# EAGLE design SR-Daughter (EAGLE 7.5.0)
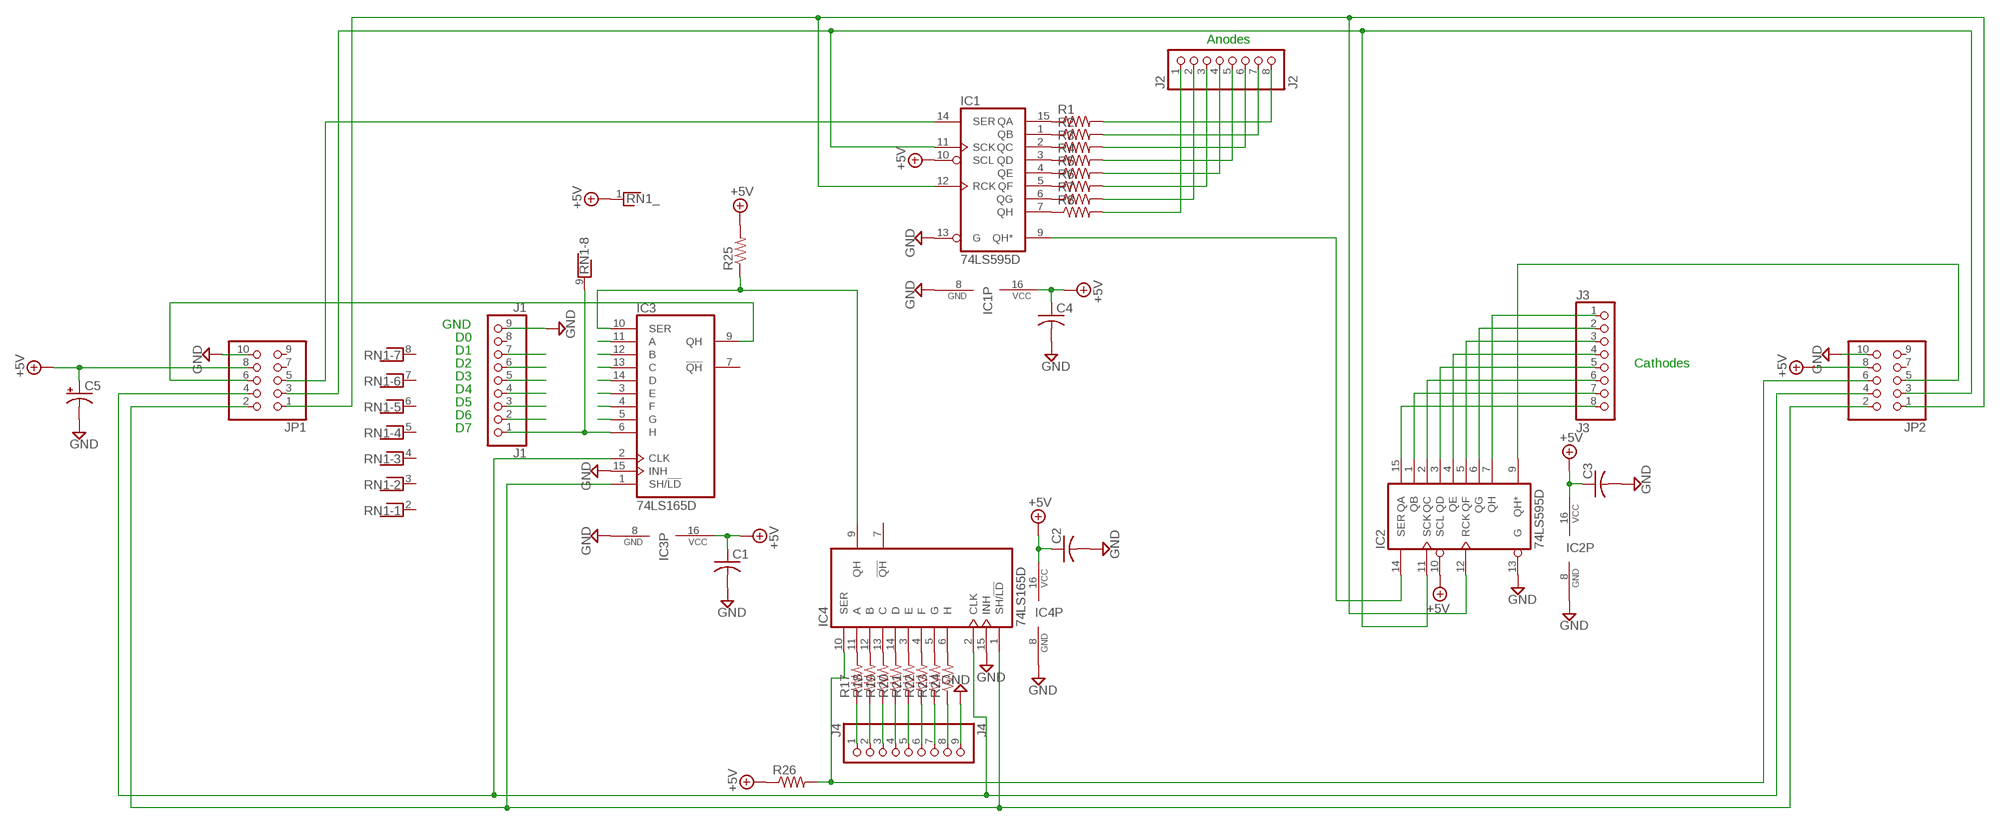
[diagram p0: schematic, sheet 1]

## Parts
C1  C-USC0603  [C0603]
C2  C-USC0603  [C0603]
C3  C-USC0603  [C0603]
C4  C-USC0603  [C0603]
C5  CPOL-USE2-5  [E2-5]
IC1  74LS595D  [SO16]
IC2  74LS595D  [SO16]
IC3  74LS165D  [SO16]
IC4  74LS165D  [SO16]
J1  J1  PINHD-1X9  [1X09]
J2  J2  PINHD-1X8  [1X08]
J3  J3  PINHD-1X8  [1X08]
J4  J4  PINHD-1X9  [1X09]
JP1  PINHD-2X5  [2X05]
JP2  PINHD-2X5  [2X05]
R1  R-US_M0805  [M0805]
R2  R-US_M0805  [M0805]
R3  R-US_M0805  [M0805]
R4  R-US_M0805  [M0805]
R5  R-US_M0805  [M0805]
R6  R-US_M0805  [M0805]
R7  R-US_M0805  [M0805]
R8  R-US_M0805  [M0805]
R17  R-US_M0805  [M0805]
R18  R-US_M0805  [M0805]
R19  R-US_M0805  [M0805]
R20  R-US_M0805  [M0805]
R21  R-US_M0805  [M0805]
R22  R-US_M0805  [M0805]
R23  R-US_M0805  [M0805]
R24  R-US_M0805  [M0805]
R25  R-US_M0805  [M0805]
R26  R-US_M0805  [M0805]
RN1  RNX8  [RN-9]

## Nets
+5V: C1.1 C2.1 C3.1 C4.1 C5.+ IC1.10(SCL) IC1.16(VCC) IC2.10(SCL) IC2.16(VCC) IC3.16(VCC) IC4.16(VCC) JP1.8 JP2.8 R25.2 R26.1 RN1.1
CLK0: IC3.2(CLK) IC4.2(CLK) JP1.4 JP2.4
CLK1: IC3.1(SH/!LD) IC4.1(SH/!LD) JP1.2 JP2.2
GND: C1.2 C2.2 C3.2 C4.2 C5.- IC1.8(GND) IC1.13(G) IC2.8(GND) IC2.13(G) IC3.8(GND) IC3.15(INH) IC4.8(GND) IC4.15(INH) J1.9 J4.9 JP1.10 JP2.10
N$1: IC1.15(QA) R1.1
N$2: IC1.1(QB) R2.1
N$3: IC1.2(QC) R3.1
N$4: IC1.3(QD) R4.1
N$5: IC1.4(QE) R5.1
N$6: IC1.5(QF) R6.1
N$7: IC1.6(QG) R7.1
N$8: IC1.7(QH) R8.1
N$9: IC3.11(A)
N$10: IC3.12(B)
N$11: J2.1 R8.2
N$12: J2.2 R7.2
N$13: J2.3 R6.2
N$14: J2.4 R5.2
N$15: J2.5 R4.2
N$16: J2.6 R3.2
N$17: J2.7 R2.2
N$18: IC3.13(C)
N$19: IC3.14(D)
N$20: IC3.3(E)
N$21: IC3.4(F)
N$22: IC3.5(G)
N$23: IC3.6(H) J1.1 RN1.9
N$24: IC4.11(A) R17.2
N$25: IC4.12(B) R18.2
N$26: J2.8 R1.2
N$27: IC2.15(QA) J3.8
N$28: IC2.1(QB) J3.7
N$29: IC2.2(QC) J3.6
N$30: IC2.3(QD) J3.5
N$31: IC2.4(QE) J3.4
N$32: IC4.13(C) R19.2
N$33: IC4.14(D) R20.2
N$34: IC2.5(QF) J3.3
N$35: IC4.3(E) R21.2
N$36: IC4.4(F) R22.2
N$37: IC4.5(G) R23.2
N$39: J1.7
N$40: IC2.6(QG) J3.2
N$41: IC2.7(QH) J3.1
N$42: J1.6
N$43: J1.5
N$44: J1.4
N$45: J1.3
N$46: J1.2
N$48: J4.1 R17.1
N$49: J4.2 R18.1
N$50: J4.3 R19.1
N$51: J4.4 R20.1
N$52: J4.5 R21.1
N$53: J4.6 R22.1
N$54: J4.7 R23.1
N$55: IC4.6(H) R24.2
N$56: J4.8 R24.1
N$57: IC3.9(QH) JP1.6
N$58: IC3.10(SER) IC4.9(QH) R25.1
N$59: IC4.10(SER) JP2.6 R26.2
N$60: IC1.14(SER) JP1.5
N$61: IC1.9(QH*) IC2.14(SER)
N$62: IC2.9(QH*) JP2.5
N$65: IC1.12(RCK) IC2.12(RCK) JP1.1 JP2.1
N$66: IC1.11(SCK) IC2.11(SCK) JP1.3 JP2.3
Unconnected: IC3.7(!QH) IC4.7(!QH) J1.8 JP1.7 JP1.9 JP2.7 JP2.9 RN1.2 RN1.3 RN1.4 RN1.5 RN1.6 RN1.7 RN1.8

## Notes on the sheet
- Anodes
- GND
- D0
- D1
- D2 | Cathodes
- D3
- D4
- D5
- D6
- D7

## Library data of the parts
C1-C4 = rcl:C-US: CAPACITOR, American symbol
C5 = rcl:CPOL-US: POLARIZED CAPACITOR, American symbol
IC1 IC2 = 74xx-us:74*595: 8-bit SHIFT REGISTER, output latch
IC3 IC4 = 74xx-us:74*165: 8-bit parallel load SHIFT REGISTER
J1 J4 = pinhead:PINHD-1X9: PIN HEADER
J2 J3 = pinhead:PINHD-1X8: PIN HEADER
JP1 JP2 = pinhead:PINHD-2X5: PIN HEADER
R1-R8 R17-R26 = resistor:R-US_: RESISTOR, American symbol
RN1 = resistor-net:RNX8: RESISTOR NETWORK; OC_FARNELL: unknown; OC_NEWARK: unknown

## Board
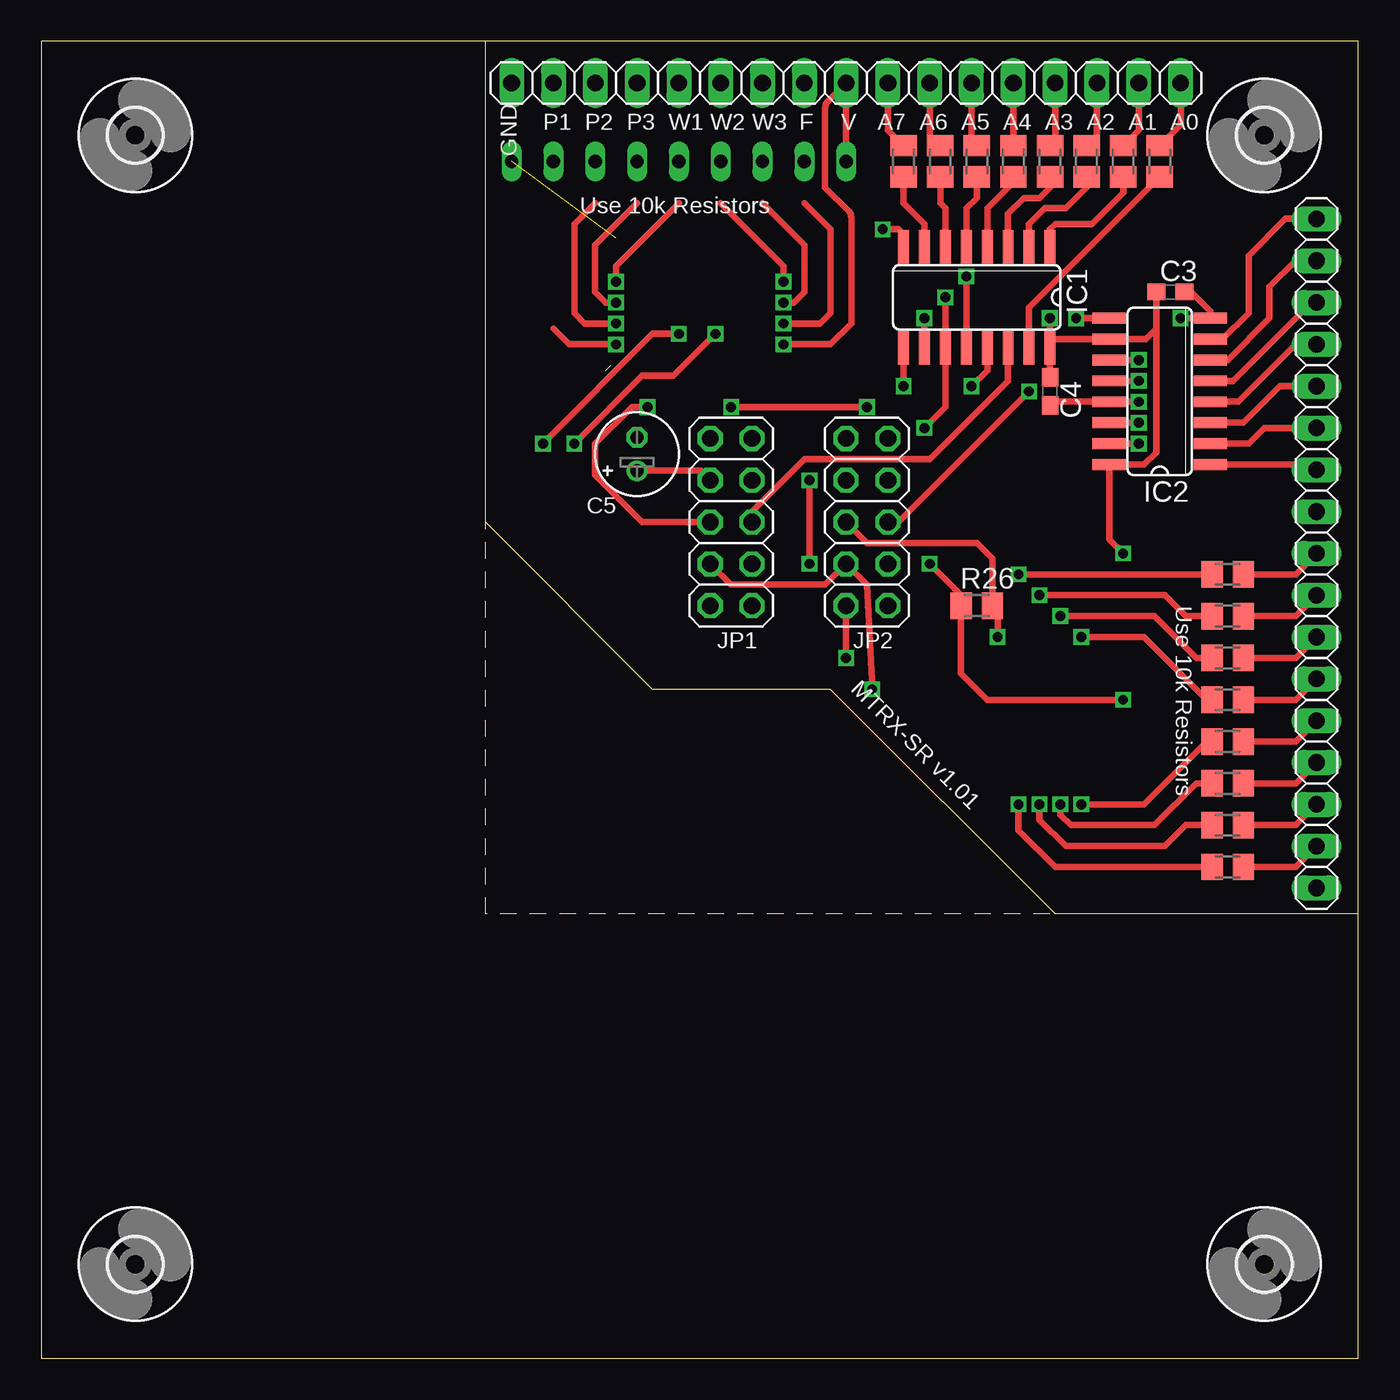
[diagram p1: board, top side]
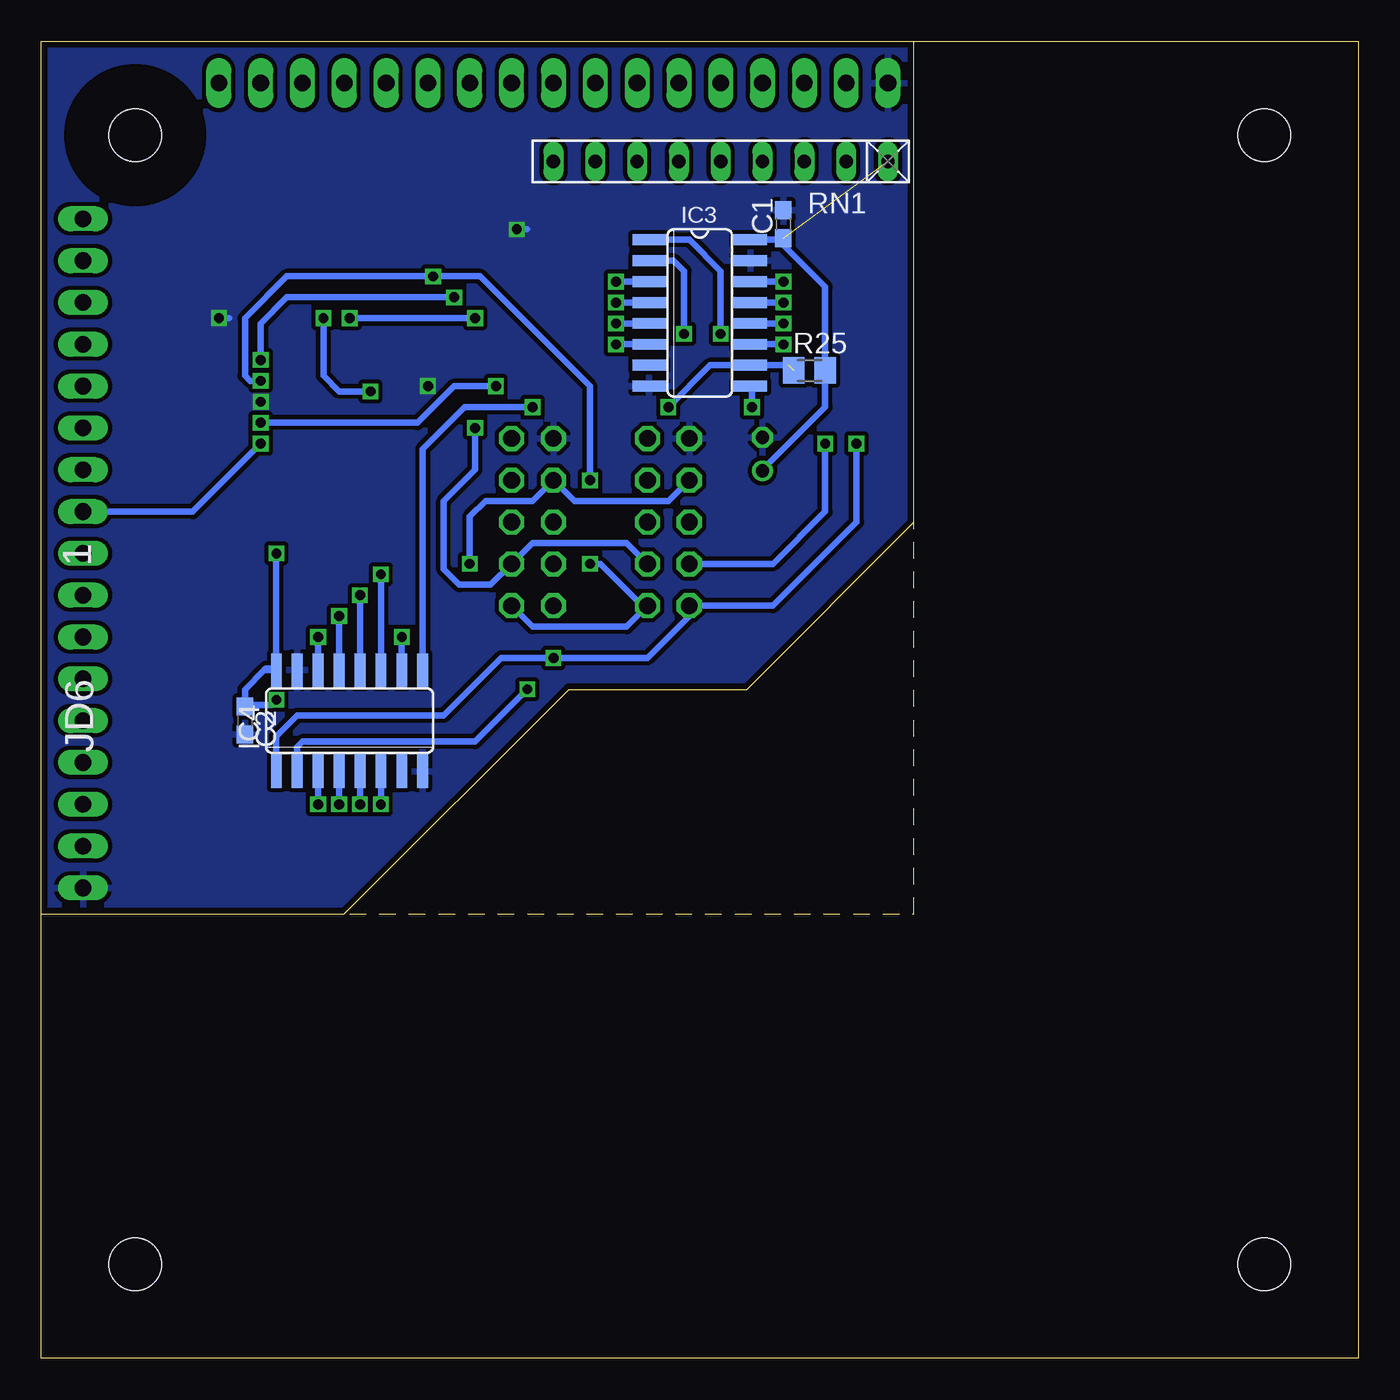
[diagram p2: board, bottom side, seen from below]

Size 80.01 x 80.01 mm. Coordinates in mm from the lower left corner, seen from the top.
Outline: 80.01,26.99 61.59,26.99 47.94,40.64 37.15,40.64 26.99,50.8
Outline: 26.99,50.8 26.99,80.01
Outline: 61.28,26.99 26.99,26.99 26.99,50.8
Outline: 0,0 80,0 80,80 0,80 0,0
Copper layers (1*16): Top 0.0356mm / dielectric 1.5011mm / Bottom 0.0356mm
Design rules "LaenPCBOrder": minimum track width 6mil, minimum drill 13mil, track to track 6mil, track to pad 6mil, pad to pad 6mil, via to via 6mil, smd to smd 6mil, copper to edge 15mil, drill to drill 6mil, minimum pad ring 7mil, minimum via ring 7mil, stop-mask expansion 4mil, vias tented up to drill 0mil, thermal gap 10mil

### Footprints (pad centres in the part's own frame; a part is rotated, then mirrored left to right if it is on the bottom)
C0603 = smd 1.1 x 1: 1 -0.85,0; 2 0.85,0
E2-5 = drill 0.813 pad 1.27: + -1.016,0 | drill 0.813 pad 1.27 octagon: - 1.016,0
SO16 = smd 0.66 x 2.032: 1 -4.445,-3.073; 2 -3.175,-3.073; 3 -1.905,-3.073; 4 -0.635,-3.073; 5 0.635,-3.073; 6 1.905,-3.073; 7 3.175,-3.073; 8 4.445,-3.073; 9 4.445,3.073; 10 3.175,3.073; 11 1.905,3.073; 12 0.635,3.073; 13 -0.635,3.073; 14 -1.905,3.073; 15 -3.175,3.073; 16 -4.445,3.073
1X09 = drill 1.016 long: 1 -10.16,0; 2 -7.62,0; 3 -5.08,0; 4 -2.54,0; 5 0,0; 6 2.54,0; 7 5.08,0; 8 7.62,0; 9 10.16,0
1X08 = drill 1.016 long: 1 -8.89,0; 2 -6.35,0; 3 -3.81,0; 4 -1.27,0; 5 1.27,0; 6 3.81,0; 7 6.35,0; 8 8.89,0
2X05 = drill 1.016 octagon: 1 -5.08,-1.27; 2 -5.08,1.27; 3 -2.54,-1.27; 4 -2.54,1.27; 5 0,-1.27; 6 0,1.27; 7 2.54,-1.27; 8 2.54,1.27; 9 5.08,-1.27; 10 5.08,1.27
M0805 = smd 1.3 x 1.6: 1 -0.95,0; 2 0.95,0
RN-9 = drill 0.813 long: 1 -10.16,0; 2 -7.62,0; 3 -5.08,0; 4 -2.54,0; 5 0,0; 6 2.54,0; 7 5.08,0; 8 7.62,0; 9 10.16,0
3,2 = hole 3.2: 0,0

### Placement (x,y rotation side)
C1  34.92,68.9 90 bottom
C2  67.63,38.73 270 bottom
C3  68.58,64.77 0 top
C4  61.28,58.74 270 top
C5  36.2,54.93 90 top
IC1  56.83,64.45 180 top
IC2  67.94,58.74 90 top
IC3  40.01,63.5 270 bottom
IC4  61.28,38.73 0 bottom
J1  38.73,77.47 180 top
J2  60.33,77.47 0 top
J3  77.47,60.33 270 top
J4  77.47,38.73 270 top
JP1  41.91,50.8 90 top
JP2  50.16,50.8 90 top
R1  67.94,72.71 90 top
R2  65.72,72.71 90 top
R3  63.5,72.71 90 top
R4  61.28,72.71 90 top
R5  59.05,72.71 90 top
R6  56.83,72.71 90 top
R7  54.61,72.71 90 top
R8  52.39,72.71 90 top
R17  72.07,47.62 180 top
R18  72.07,45.09 180 top
R19  72.07,42.55 180 top
R20  72.07,40.01 180 top
R21  72.07,37.47 180 top
R22  72.07,34.92 180 top
R23  72.07,32.38 180 top
R24  72.07,29.84 180 top
R25  33.34,60.01 0 bottom
R26  56.83,45.72 0 top
RN1  38.73,72.71 180 bottom
U$1  [3,2]  5.71,74.3 0 top
U$2  [3,2]  74.3,74.3 0 top
U$3  [3,2]  74.3,5.71 0 top
U$4  [3,2]  5.71,5.71 0 top

### Tracks (layer width: path | path; a pad name or v marks a point on that pad's centre or on a via)
+5V  (via drill 0.6)  (1 unrouted)
  Top 0.406: IC1.16 61.18,61.91 IC2.10 67.09,61.91 67.73,62.55 | IC1.16 C4.1 | R26.1 55.88,46.35 | v65.72,48.9 64.87,49.75 IC2.16 66.99,54.29 67.73,55.03 67.73,62.55 | 67.73,62.55 C3.1 | v53.66,63.18 IC1.10 | IC1.16 v61.28,63.18 | C5.+ 40.07,53.91 JP1.8 | v53.98,48.26 55.88,46.35 | 55.88,46.35 55.88,41.59 57.47,40.01 v65.72,40.01
  Bottom 0.406: 65.82,41.81 IC4.16 v65.72,48.9 | 66.46,41.81 67.63,40.64 C2.1 | 66.46,41.81 65.82,41.81 | 65.82,41.81 65.72,41.91 66.36,41.91 66.46,41.81 | IC3.16 35.03,67.94 C1.1 34.92,67.63 32.38,65.09 R25.2 | R25.2 | R25.2 32.38,57.78 36.2,53.98 C5.+ | JP1.8 41.91,52.07 47.62,52.07 JP2.8 50.16,52.07 53.02,52.07 53.98,51.12 v53.98,48.26 | C2.1 67.63,39.37 | v61.28,63.18 v53.66,63.18 | C2.1 67.53,39.69 66.04,39.69 v65.72,40.01
CLK0  (via drill 0.6)
  Top 0.406: JP1.4 41.91,46.99 47.62,46.99 JP2.4 50.16,46.99 v50.48,40.64 | v40.96,62.23 38.42,59.69 36.51,59.69 v32.38,55.56
  Bottom 0.406: IC4.2 64.45,37.15 64.14,37.47 53.66,37.47 v50.48,40.64 | IC3.2 41.59,66.67 40.96,66.04 v40.96,62.23 | v32.38,55.56 32.38,51.44 35.56,48.26 JP1.4
CLK1  (via drill 0.6)
  Top 0.406: v48.9,42.55 JP2.2 | v38.73,62.23 37.15,62.23 v30.48,55.56
  Bottom 0.406: IC4.1 65.72,37.78 64.45,39.05 55.56,39.05 52.07,42.55 v48.9,42.55 43.18,42.55 40.64,45.09 JP1.2 35.56,45.72 30.48,50.8 v30.48,55.56 | IC3.1 40.64,67.94 38.73,66.04 v38.73,62.23
GND  (via drill 0.6)
  Top 0.406: IC1.13 57.47,60.01 v56.52,59.05 | C3.2 69.85,64.77 71.02,63.6 IC2.8 v69.22,63.18 | v66.67,58.1 IC2.13 61.49,58.1 C4.2 61.38,57.78 | v51.12,68.58 52.07,68.58 52.39,68.26 IC1.8 52.39,66.99
  Bottom 0.406: v51.12,68.58 50.48,68.58 | v69.22,63.18 68.58,63.18
  pour Bottom (isolate 0.254): -0.32,80.33 80.33,80.33 80.33,-0.32 -0.32,-0.32
N$1
  Top 0.406: IC1.15 60.01,63.82 67.63,71.44 R1.1
N$2
  Top 0.406: IC1.1 61.28,68.58 61.59,68.9 63.82,68.9 65.72,70.8 R2.1
N$3
  Top 0.406: IC1.2 60.01,68.9 60.96,69.85 62.23,69.85 63.5,71.12 R3.1
N$4
  Top 0.406: IC1.3 58.74,69.53 59.69,70.48 60.64,70.48 61.28,71.12 R4.1
N$5
  Top 0.406: R5.1 59.05,71.44 57.47,69.85 IC1.4
N$6
  Top 0.406: R6.1 56.83,70.48 56.2,69.85 IC1.5
N$7
  Top 0.406: R7.1 54.61,70.17 54.93,69.85 IC1.6
N$8
  Top 0.406: IC1.7 53.66,68.9 52.39,70.17 R8.1
N$9  (via drill 0.6)
  Top 0.406: v34.92,61.59 32.07,61.59 31.11,62.55
  Bottom 0.406: v34.92,61.59 IC3.11
N$10  (via drill 0.6)
  Top 0.406: v34.92,62.87 33.02,62.87 32.38,63.5 32.38,68.9 33.66,70.17
  Bottom 0.406: v34.92,62.87 IC3.12
N$11
  Top 0.406: J2.1 51.44,74.61 R8.2
N$12
  Top 0.406: J2.2 53.98,74.29 R7.2
N$13
  Top 0.406: J2.3 56.52,73.97 R6.2
N$14
  Top 0.406: R5.2 J2.4
N$15
  Top 0.406: J2.5 61.59,73.97 R4.2
N$16
  Top 0.406: J2.6 64.14,74.29 R3.2
N$17
  Top 0.406: J2.7 66.67,74.61 R2.2
N$18  (via drill 0.6)
  Top 0.406: v34.92,64.14 34.29,64.14 33.66,64.77 33.66,67.63 36.2,70.17
  Bottom 0.406: v34.92,64.14 IC3.13
N$19  (via drill 0.6)
  Top 0.406: v34.92,65.41 34.92,66.36 38.73,70.17
  Bottom 0.406: v34.92,65.41 IC3.14
N$20  (via drill 0.6)
  Top 0.406: v45.09,65.41 45.09,66.36 41.27,70.17
  Bottom 0.406: IC3.3 v45.09,65.41
N$21  (via drill 0.6)
  Top 0.406: 43.81,70.17 46.35,67.63 46.35,64.77 45.72,64.14 v45.09,64.14
  Bottom 0.406: IC3.4 v45.09,64.14
N$22  (via drill 0.6)
  Top 0.406: v45.09,62.87 47.31,62.87 47.94,63.5 47.94,68.58 46.35,70.17
  Bottom 0.406: IC3.5 v45.09,62.87
N$23  (via drill 0.6)
  Top 0.406: v45.09,61.59 47.94,61.59 49.21,62.87 49.21,69.27 arc45 49.03,69.72 47.62,71.12 47.62,75.94 arc-45 47.81,76.39 J1.1 RN1.9
  Bottom 0.406: IC3.6 v45.09,61.59
N$24  (via drill 0.6)
  Top 0.406: v59.37,47.62 R17.2
  Bottom 0.406: IC4.11 v59.37,47.62
N$25  (via drill 0.6)
  Top 0.406: R18.2 69.53,45.09 68.26,46.35 v60.64,46.35
  Bottom 0.406: IC4.12 v60.64,46.35
N$26
  Top 0.406: J2.8 69.22,74.93 R1.2
N$27  (via drill 0.6)
  Top 0.406: IC2.15 v66.67,55.56
  Bottom 0.406: J3.8 70.8,51.44 v66.67,55.56
N$28
  Top 0.406: IC2.1 77.15,54.29 J3.7
N$29
  Top 0.406: J3.6 74.3,56.52 73.34,55.56 IC2.2
N$30
  Top 0.406: J3.5 75.25,59.05 73.03,56.83 IC2.3
N$31
  Top 0.406: J3.4 76.2,61.59 72.71,58.1 IC2.4
N$32  (via drill 0.6)
  Top 0.406: R19.2 70.17,42.55 67.63,45.09 v61.91,45.09
  Bottom 0.406: IC4.13 v61.91,45.09
N$33  (via drill 0.6)
  Top 0.406: R20.2 70.8,40.01 66.99,43.81 v63.18,43.81
  Bottom 0.406: IC4.14 v63.18,43.81
N$34
  Top 0.406: J3.3 77.15,64.14 72.39,59.37 IC2.5
N$35  (via drill 0.6)
  Top 0.406: R21.2 70.8,37.47 66.99,33.66 v63.18,33.66
  Bottom 0.406: v63.18,33.66 IC4.3
N$36  (via drill 0.6)
  Top 0.406: R22.2 70.17,34.92 67.63,32.38 62.55,32.38 61.91,33.02 v61.91,33.66
  Bottom 0.406: v61.91,33.66 IC4.4
N$37  (via drill 0.6)
  Top 0.406: R23.2 69.53,32.38 68.26,31.11 62.23,31.11 60.64,32.7 v60.64,33.66
  Bottom 0.406: v60.64,33.66 IC4.5
N$40
  Top 0.406: IC2.6 72.07,60.64 74.61,63.18 74.61,65.09 76.2,66.67 J3.2
N$41
  Top 0.406: IC2.7 71.75,61.91 73.34,63.5 73.34,66.99 75.56,69.22 J3.1
N$48
  Top 0.406: R17.1 76.2,47.62 J4.1
N$49
  Top 0.406: R18.1 76.2,45.09 J4.2
N$50
  Top 0.406: R19.1 76.2,42.55 J4.3
N$51
  Top 0.406: R20.1 76.2,40.01 J4.4
N$52
  Top 0.406: R21.1 76.2,37.47 J4.5
N$53
  Top 0.406: R22.1 76.2,34.92 J4.6
N$54
  Top 0.406: R23.1 76.2,32.38 J4.7
N$55  (via drill 0.6)
  Top 0.406: R24.2 61.59,29.84 59.37,32.07 v59.37,33.66
  Bottom 0.406: v59.37,33.66 IC4.6
N$56
  Top 0.406: R24.1 76.2,29.84 J4.8
N$57  (via drill 0.6)
  Top 0.406: JP1.6 36.51,50.8 33.66,53.66 33.66,55.56 35.88,57.78 v36.83,57.78
  Bottom 0.406: v36.83,57.78 36.83,58.95 IC3.9
N$58  (via drill 0.6)  (1 unrouted)
  Top 0.406: v41.91,57.78 v50.16,57.78
  Bottom 0.406: 34.6,60.33 IC3.10 39.37,60.33 v41.91,57.78 | IC4.9 56.83,55.24 54.29,57.78 v50.16,57.78
N$59  (via drill 0.6)
  Top 0.406: v58.1,43.81 58.1,45.4 R26.2 57.78,48.58 56.83,49.53 50.16,49.53 JP2.6
  Bottom 0.406: IC4.10 v58.1,43.81
N$60
  Top 0.406: IC1.14 58.74,59.37 53.98,54.61 46.35,54.61 43.18,51.44 JP1.5
N$61  (via drill 0.6)
  Top 0.406: v66.67,56.83 IC2.14 | v52.39,59.05 IC1.9
  Bottom 0.406: v66.67,56.83 57.15,56.83 54.93,59.05 v52.39,59.05
N$62  (via drill 0.6)
  Top 0.406: JP2.5 52.07,50.8 v60.01,58.74 | v62.87,63.18 IC2.9
  Bottom 0.406: v60.01,58.74 61.91,58.74 62.87,59.69 v62.87,63.18
N$65  (via drill 0.6)
  Top 0.406: v66.67,59.37 IC2.12 | v56.2,65.72 IC1.12 | v46.67,48.26 v46.67,53.34
  Bottom 0.406: JP2.1 50.16,44.45 44.45,44.45 JP1.1 43.5,45.72 46.04,48.26 v46.67,48.26 | v66.67,59.37 67.31,59.37 67.63,59.69 67.63,63.18 65.09,65.72 v56.2,65.72 53.34,65.72 46.67,59.05 v46.67,53.34
N$66  (via drill 0.6)
  Top 0.406: v66.67,60.64 IC2.11 | v54.93,64.45 IC1.11 54.93,57.78 v53.66,56.52
  Bottom 0.406: JP1.3 44.45,49.53 50.16,49.53 JP2.3 52.7,46.99 54.61,46.99 55.56,47.94 55.56,52.07 53.66,53.98 v53.66,56.52 | v66.67,60.64 66.67,62.87 65.09,64.45 v54.93,64.45

### Text on the board
bPlace: 1 | JD6
tOrigins: C7 | C6 | C5 | C4 | C3 | C2 | C1 | C0 | E1 | E2 | L1 | L2 | L3 | L4 | L5 | L6 | GND
tNames: P1 | P2 | P3 | W1 | W2 | W3 | F | V | A7 | A6 | A5 | A4 | A3 | A2 | A1 | A0 | GND | Use 10k Resistors | Use 10k Resistors | MTRX-SR v1.01